# Altium schematic sheet Sheet1.SchDoc
size A3
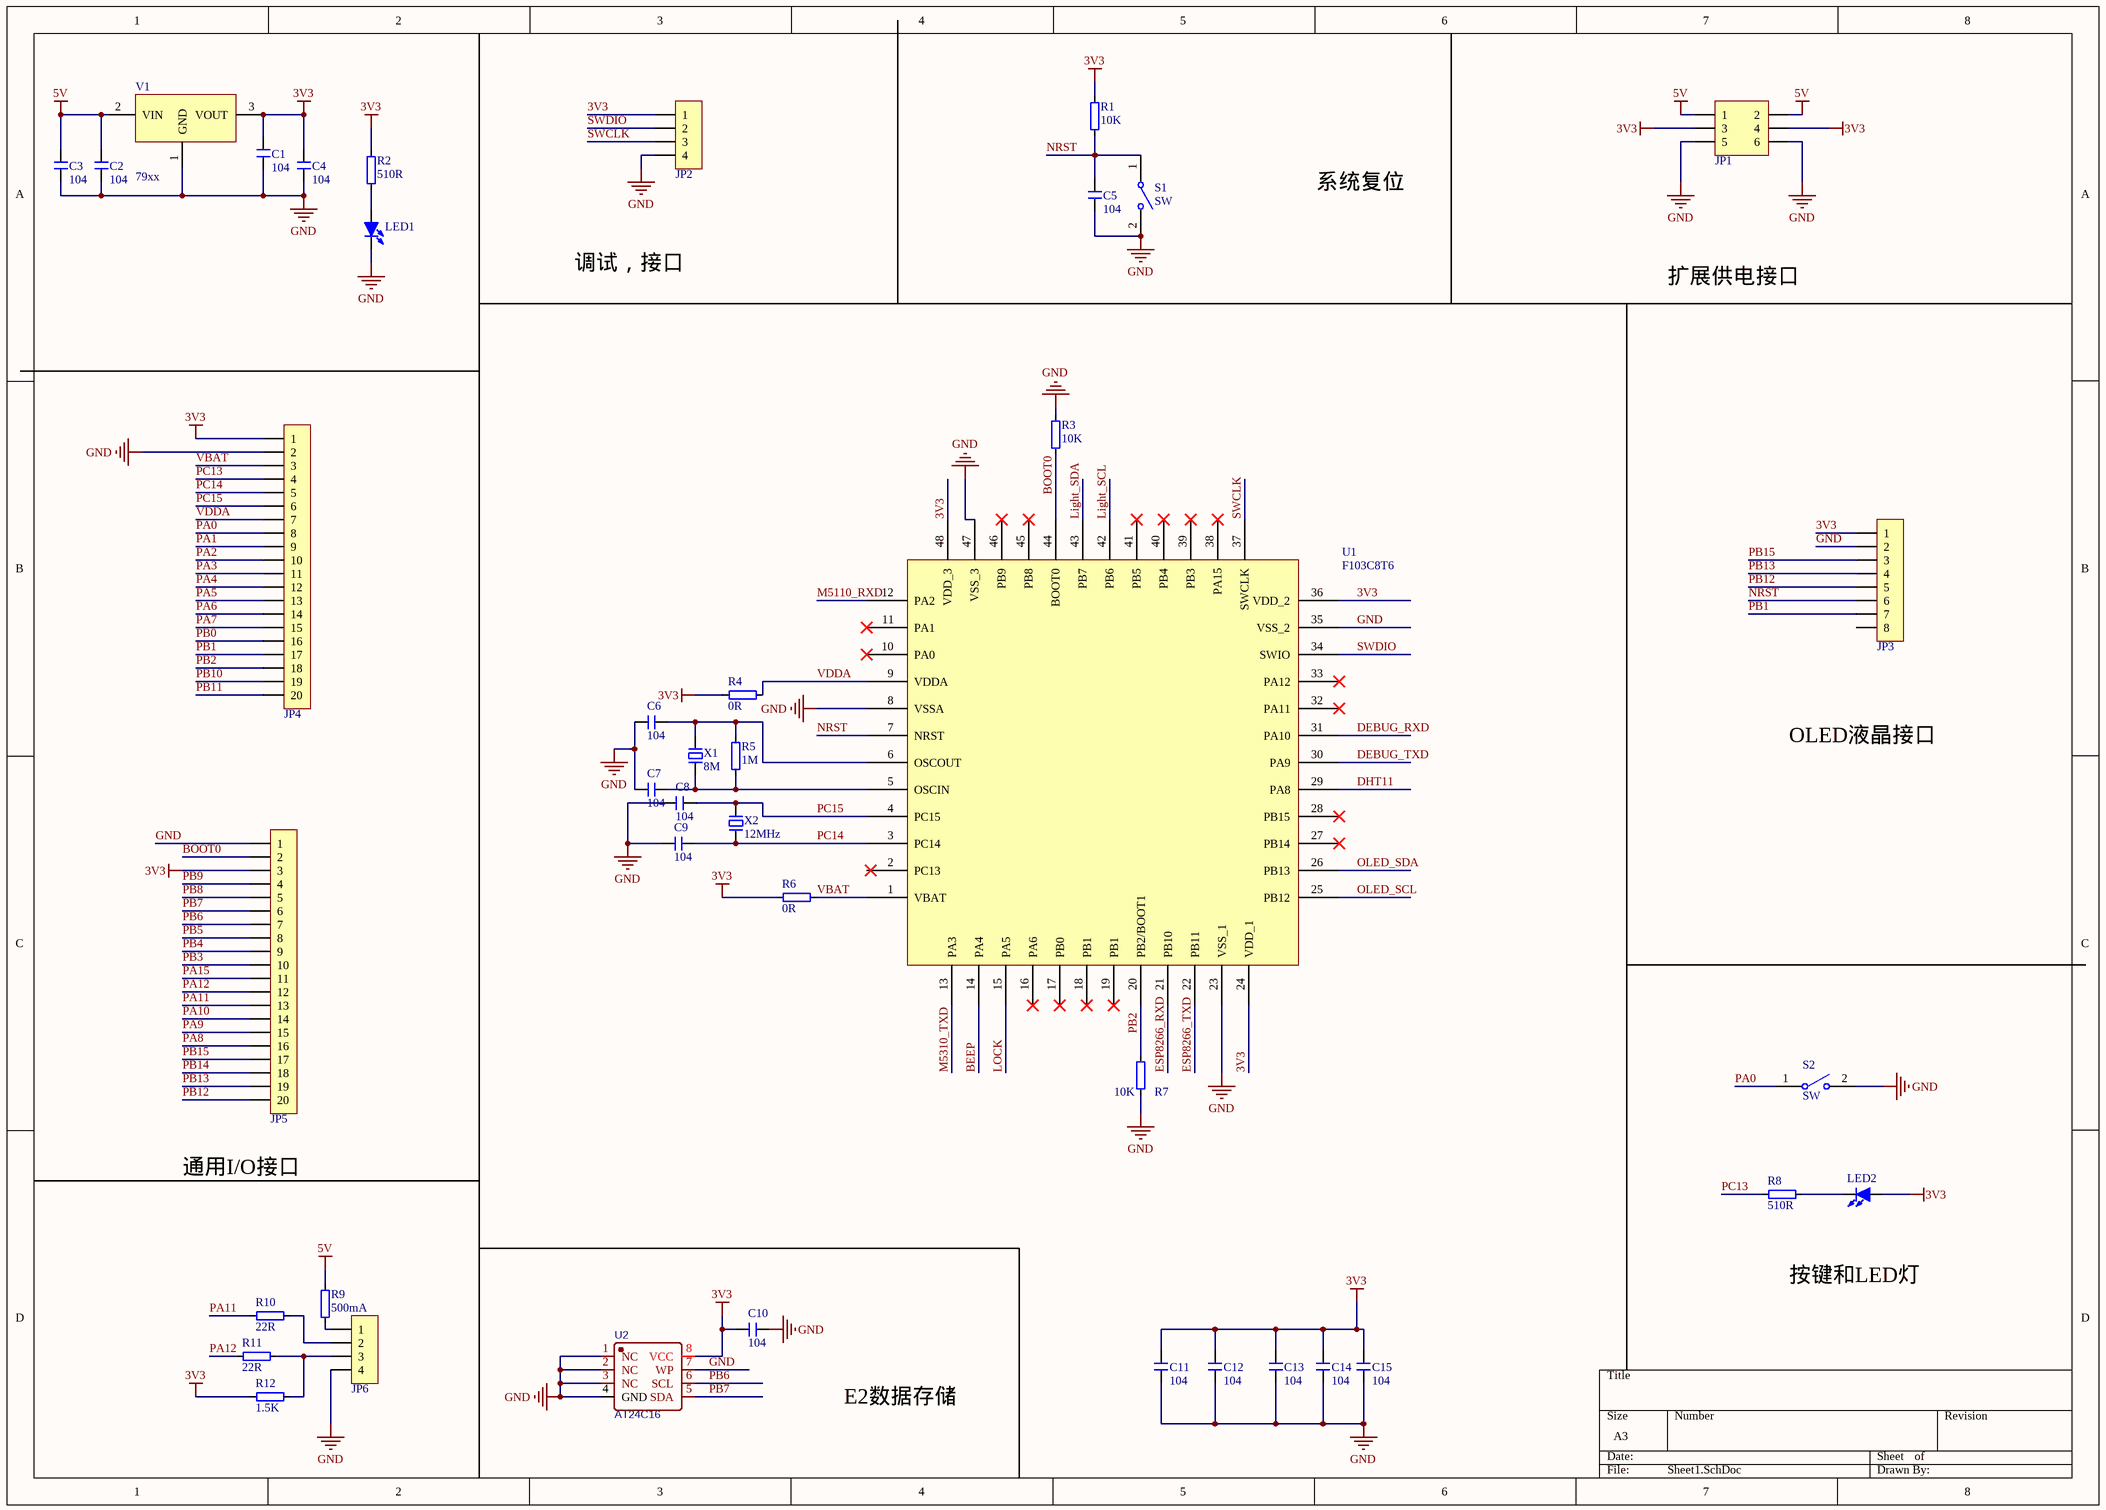
[diagram p0: Sheet1.SchDoc]

## Parts
C1  104  [0603C]
C2  104  [0603C]
C3  104  [0603C]
C4  104  [0603C]
C5  104  [0603C]
C6  104  [0603C]
C7  104  [0603C]
C8  104  [0603C]
C9  104  [0603C]
C10  104  [0603C]
C11  104  [0603C]
C12  104  [0603C]
C13  104  [0603C]
C14  104  [0603C]
C15  104  [0603C]
JP1  Header3X2  [HDR2.54-LI-2x3P]  (value not drawn)
JP2  HDR-1X4  [HDR2.54-LI-4P]  (value not drawn)
JP3  HDR-1X8  [HDR2.54-LI-8P]  (value not drawn)
JP4  HDR-1X20  [HDR2.54-LI-20P]  (value not drawn)
JP5  HDR-1X20  [HDR2.54-LI-20P]  (value not drawn)
JP6  HDR-1X4  [HDR2.54-LI-4P]  (value not drawn)
LED1  (no value)  [LED 0603G]
LED2  (no value)  [LED 0603G]
R1  10K  [R 0603_M]
R2  510R  [R 0603_M]
R3  10K  [R 0603_M]
R4  0R  [R 0603_M]
R5  1M  [R 0603_M]
R6  0R  [R 0603_M]
R7  10K  [R 0603_M]
R8  510R  [R 0603_M]
R9  500mA  [R 0603_M]
R10  22R  [R 0603_M]
R11  22R  [R 0603_M]
R12  1.5K  [R 0603_M]
S1  SW  [TSW SMD-3*6*5]
S2  SW  [TSW SMD-3*6*5]
U1  F103C8T6  [LQFP-48_M]
U2  AT24C16  [SOP-8_L5.0-W4.0-P1.27-LS6.0-BL]
V1  79xx  [SOT-223]
X1  8M  [OSC UM-5 - duplicate]
X2  12MHz  [OSC UM-5 - duplicate]

## Nets
3V3: C1.2 C4.2 C10.1 C11.2 C12.2 C13.2 C14.2 C15.2 JP1.3 JP1.4 JP2.1 JP3.1 JP4.1 JP5.3 LED2.1(A) R1.2 R2.2 R4.1 R6.1 R12.1 U1.24(VDD_1) U1.36(VDD_2) U1.48(VDD_3) U2.8(VCC) V1.3(VOUT)
5V: C2.2 C3.2 JP1.1 JP1.2 R9.2 V1.2(VIN)
GND: C1.1 C2.1 C3.1 C4.1 C5.1 C6.1 C7.1 C8.2 C9.2 C10.2 C11.1 C12.1 C13.1 C14.1 C15.1 JP1.5 JP1.6 JP2.4 JP3.2 JP4.2 JP5.1 JP6.4 LED1.2(K) R3.2 R7.1 S1.2 S2.2 U1.8(VSSA) U1.23(VSS_1) U1.35(VSS_2) U1.47(VSS_3) U2.1(NC) U2.2(NC) U2.3(NC) U2.4(GND) U2.7(WP) V1.1(GND)
BEEP: U1.14(PA4)
BOOT0: JP5.2 R3.1 U1.44(BOOT0)
DEBUG_RXD: U1.31(PA10)
DEBUG_TXD: U1.30(PA9)
DHT11: U1.29(PA8)
ESP8266_RXD: U1.21(PB10)
ESP8266_TXD: U1.22(PB11)
Light_SCL: U1.42(PB6)
Light_SDA: U1.43(PB7)
LOCK: U1.15(PA5)
M5110_RXD: U1.12(PA2)
M5310_TXD: U1.13(PA3)
NRST: C5.2 JP3.6 R1.1 S1.1 U1.7(NRST)
OLED_SCL: U1.25(PB12)
OLED_SDA: U1.26(PB13)
PA0: JP4.8 S2.1
PA1: JP4.9
PA2: JP4.10
PA3: JP4.11
PA4: JP4.12
PA5: JP4.13
PA6: JP4.14
PA7: JP4.15
PA8: JP5.16
PA9: JP5.15
PA10: JP5.14
PA11: JP5.13 R10.1
PA12: JP5.12 R11.1
PA15: JP5.11
PB0: JP4.16
PB1: JP3.7 JP4.17
PB2: JP4.18 R7.2 U1.20(PB2/BOOT1)
PB3: JP5.10
PB4: JP5.9
PB5: JP5.8
PB6: JP5.7 U2.6(SCL)
PB7: JP5.6 U2.5(SDA)
PB8: JP5.5
PB9: JP5.4
PB10: JP4.19
PB11: JP4.20
PB12: JP3.5 JP5.20
PB13: JP3.4 JP5.19
PB14: JP5.18
PB15: JP3.3 JP5.17
PC13: JP4.4 R8.1
PC14: C9.1 JP4.5 U1.3(PC14) X2.1
PC15: C8.1 JP4.6 U1.4(PC15) X2.2
SWCLK: JP2.3 U1.37(SWCLK)
SWDIO: JP2.2 U1.34(SWIO)
VBAT: JP4.3 R6.2 U1.1(VBAT)
VDDA: JP4.7 R4.2 U1.9(VDDA)
NetC6_2: C6.2 R5.2 U1.6(OSCOUT) X1.2
NetC7_2: C7.2 R5.1 U1.5(OSCIN) X1.1
NetJP6_1: JP6.1 R9.1
NetJP6_2: JP6.2 R10.2
NetJP6_3: JP6.3 R11.2 R12.2
NetLED1_1: LED1.1(A) R2.1
NetLED2_2: LED2.2(K) R8.2

Not connected (* = marked no-connect by the designer): JP3 8; U1 2(PC13) 10(PA0)* 11(PA1)* 16(PA6)* 17(PB0)* 18(PB1)* 19(PB1)* 27(PB14)* 28(PB15)* 32(PA11)* 33(PA12)* 38(PA15)* 39(PB3)* 40(PB4)* 41(PB5)* 45(PB8)* 46(PB9)*

## Notes on the sheet
- 系统复位
- 调试，接口
- 扩展供电接口
- OLED液晶接口
- 通用I/O接口
- 按键和LED灯
- E2数据存储

## Library data of the parts
C1-C15 = C: 无极性贴片电容; 版权归属: 源创客; BOM名称: 无极性贴片电容; 学习资源: www.ooocke.com
JP1 = Header 3X2: 3*2P接插件; 版权归属: 源创客; BOM名称: 3*2P接插件; 学习资源: www.ooocke.com
JP2 JP6 = Header 4: 4P接插件; 版权归属: 源创客; BOM名称: 4P接插件; 学习资源: www.ooocke.com
JP3 = Header 8: 8P接插件; 版权归属: 源创客; BOM名称: 8P接插件; 学习资源: www.ooocke.com
JP4 JP5 = Header 20: 20P接插件; 版权归属: 源创客; BOM名称: 20P接插件; 学习资源: www.ooocke.com
LED1 LED2 = LED-SMD: 贴片LED; 版权归属: 源创客; BOM名称: 贴片LED; 学习资源: www.ooocke.com
R1-R12 = 普通电阻
S1 S2 = KCD1-101: 1路单刀船型开关; 版权归属: 源创客; BOM名称: 1路单刀船型开关; 学习资源: www.ooocke.com
U1 = STM32F103C8T6: IC
U2 = AT24C16: BOM_Manufacturer: IDCHIP; Contributor: LCSC; BOM_Supplier: LCSC; BOM_Supplier Part: C561263; BOM_Manufacturer Part: AT24C16; spicePre: U; spiceSymbolName: AT24C16
V1 = 79xx: 线性稳压芯片; 版权归属: 源创客; BOM名称: 线性稳压芯片; 学习资源: www.ooocke.com
X1 X2 = XTAL-2P: 2脚无源脚晶振; 版权归属: 源创客; BOM名称: 2脚无源脚晶振; 学习资源: www.ooocke.com